# EAGLE design tuya-jailbeaker (EAGLE 9.6.2)
CNAME: None; CREVISION: 1; DESIGNER: Joao Silva
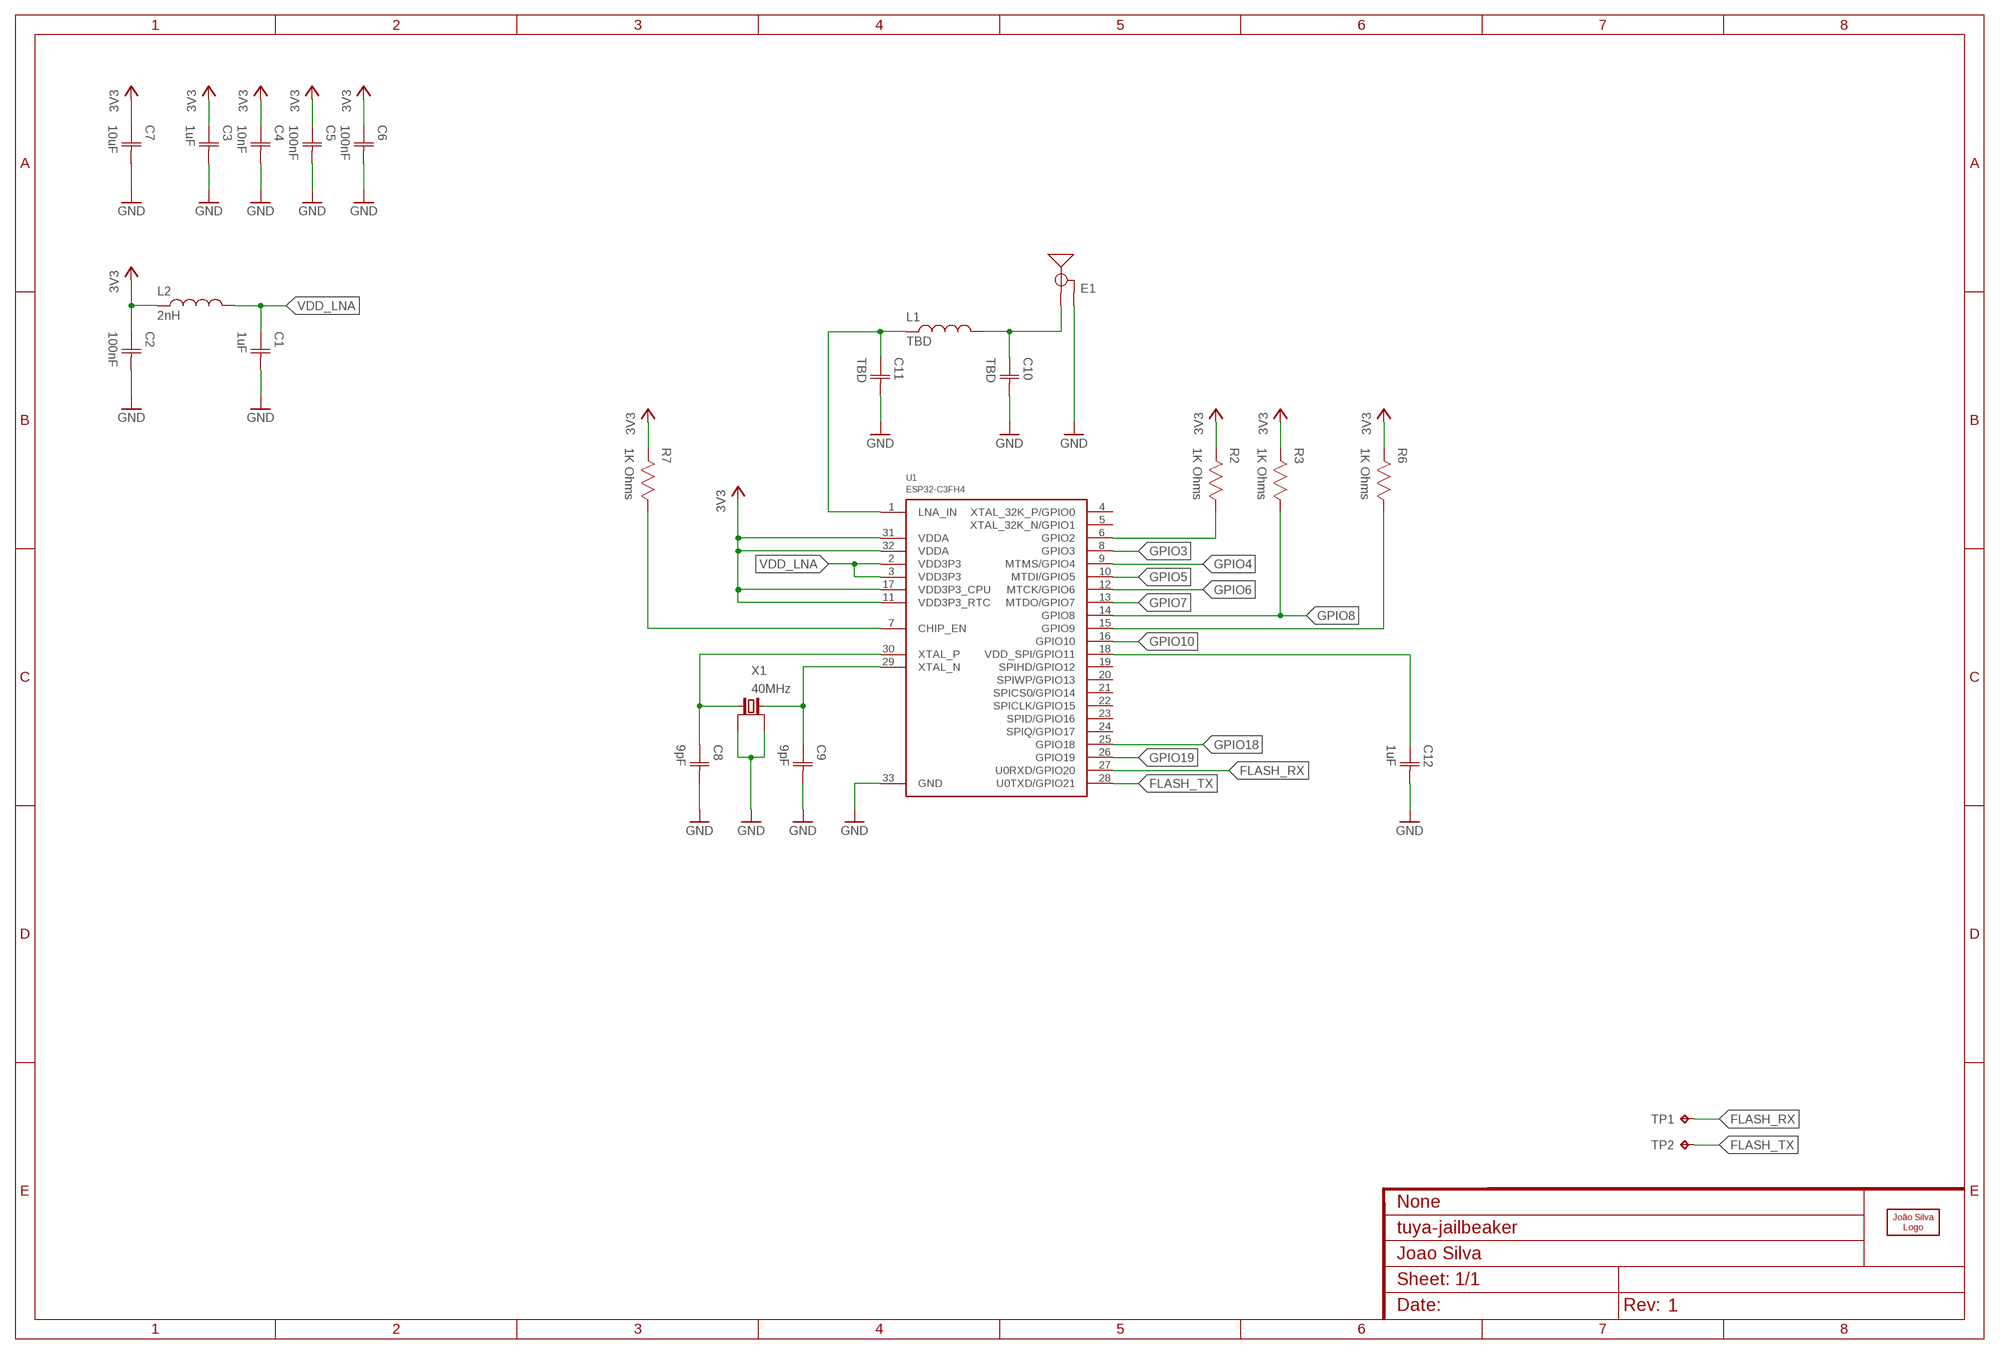
[diagram p0: schematic, sheet 1]

## Parts
C1  1uF  CAPACITOR-0402  [CAP0402]
C2  100nF  CAPACITOR-0402  [CAP0402]
C3  1uF  CAPACITOR-0402  [CAP0402]
C4  10nF  CAPACITOR-0402  [CAP0402]
C5  100nF  CAPACITOR-0402  [CAP0402]
C6  100nF  CAPACITOR-0402  [CAP0402]
C7  10uF  CAPACITOR-0603  [CAP0603]
C8  9pF  CAPACITOR-0402  [CAP0402]
C9  9pF  CAPACITOR-0402  [CAP0402]
C10  TBD  CAPACITOR-0402  [CAP0402]
C11  TBD  CAPACITOR-0402  [CAP0402]
C12  1uF  CAPACITOR-0402  [CAP0402]
E1  2.4GHZ  [OLIMEX_ANT_ESP8266_ANT]
L1  TBD  INDUCTOR-0402  [IND0402]
L2  2nH  INDUCTOR-0402  [IND0402]
LOGO1  JS-5MM  [JS_5MM]
R2  1K Ohms  RESISTOR-0402  [RES0402]
R3  1K Ohms  RESISTOR-0402  [RES0402]
R6  1K Ohms  RESISTOR-0402  [RES0402]
R7  1K Ohms  RESISTOR-0402  [RES0402]
TP1  TESTPOINT-1.27MM  [PAD1.27MM]
TP2  TESTPOINT-1.27MM  [PAD1.27MM]
U1  ESP32-C3FH4  [QFN32]
X1  40MHz  CRYSTAL_4P-2520  [4-SMD-2520]

## Nets
3V3: C2.1(C1) C3.1(C1) C4.1(C1) C5.1(C1) C6.1(C1) C7.1(C1) L2.1 R2.2 R3.2 R6.2 R7.2 U1.11(VDD3P3_RTC) U1.17(VDD3P3_CPU) U1.31(VDDA) U1.32(VDDA)
ANT: C10.1(C1) E1.ANT(SIGNAL) L1.2
CEN: R7.1 U1.7(CHIP_EN)
FLASH_RX: TP1.TP U1.27(U0RXD/GPIO20)
FLASH_TX: TP2.TP U1.28(U0TXD/GPIO21)
GND: C1.2(C2) C2.2(C2) C3.2(C2) C4.2(C2) C5.2(C2) C6.2(C2) C7.2(C2) C8.2(C2) C9.2(C2) C10.2(C2) C11.2(C2) C12.2(C2) E1.GND U1.33(GND) X1.2(GND) X1.4(GND)
GPIO2: R2.1 U1.6(GPIO2)
GPIO3: U1.8(GPIO3)
GPIO4: U1.9(MTMS/GPIO4)
GPIO5: U1.10(MTDI/GPIO5)
GPIO6: U1.12(MTCK/GPIO6)
GPIO7: U1.13(MTDO/GPIO7)
GPIO8: R3.1 U1.14(GPIO8)
GPIO9: R6.1 U1.15(GPIO9)
GPIO10: U1.16(GPIO10)
GPIO18: U1.25(GPIO18)
GPIO19: U1.26(GPIO19)
LNA_IN: C11.1(C1) L1.1 U1.1(LNA_IN)
VDD_LNA: C1.1(C1) L2.2 U1.2(VDD3P3) U1.3(VDD3P3)
VDD_SPI: C12.1(C1) U1.18(VDD_SPI/GPIO11)
XTALN: C9.1(C1) U1.29(XTAL_N) X1.1
XTALP: C8.1(C1) U1.30(XTAL_P) X1.3
Unconnected: U1.4(XTAL_32K_P/GPIO0) U1.5(XTAL_32K_N/GPIO1) U1.19(SPIHD/GPIO12) U1.20(SPIWP/GPIO13) U1.21(SPICS0/GPIO14) U1.22(SPICLK/GPIO15) U1.23(SPID/GPIO16) U1.24(SPIQ/GPIO17)

## Library data of the parts
C1-C12 = Capacitor:CAPACITOR
E1 = Antenna:2.4GHZ
L1 L2 = Inductor:INDUCTOR
LOGO1 = Silkscreen:JS
R2 R3 R6 R7 = Resistor:RESISTOR
TP1 TP2 = PADs:TESTPOINT
U1 = Espressif:ESP32-C3*
X1 = Crystal:CRYSTAL_4P; OCLCSC: C709005

## Board
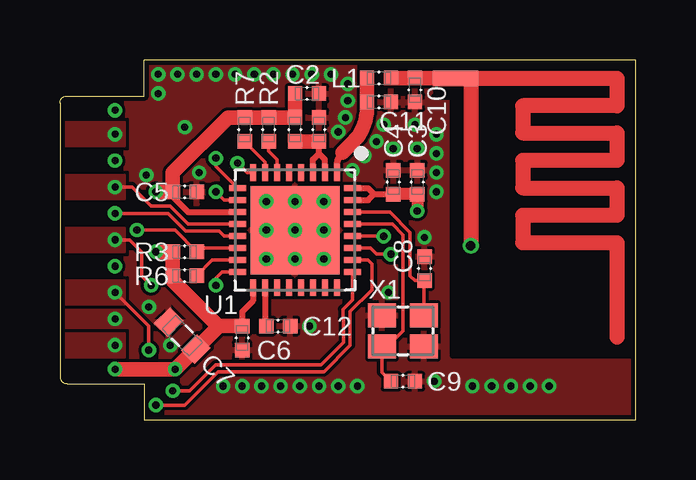
[diagram p1: board, top side]
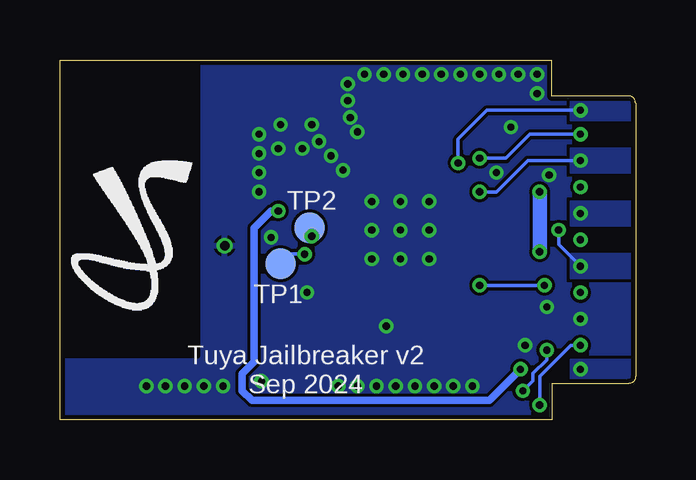
[diagram p2: board, bottom side, seen from below]

Size 24 x 15 mm. Coordinates in mm from the lower left corner, seen from the top.
Outline: 3.5,0 24,0 24,15 3.5,15 3.5,13.5 0.3,13.5 arc90 0,13.2 0,1.8 arc90 0.3,1.5 3.5,1.5 3.5,0
Copper layers (1*16): Top 0.035mm / dielectric 1.6mm / Bottom 0.035mm
Design rules "jlcpcb_2layer": minimum track width 5mil, minimum drill 0.3mm, track to track 5mil, track to pad 5mil, pad to pad 5mil, via to via 5mil, smd to smd 5mil, copper to edge 0.2mm, drill to drill 5mil, minimum pad ring 0.13mm, minimum via ring 0.1mm, stop-mask expansion 0.04mm, vias tented up to drill 10mm, thermal gap 5mil

### Footprints (pad centres in the part's own frame; a part is rotated, then mirrored left to right if it is on the bottom)
CAP0402 = smd 0.6 x 0.6: 1 -0.5,0; 2 0.5,0
CAP0603 = smd 0.8 x 0.95: 1 -0.8,0; 2 0.8,0
OLIMEX_ANT_ESP8266_ANT = smd 0.635 x 1.905: ANT -5.334,-3.302 | drill 0.4 pad 0.635: GND 1.651,-2.667
IND0402 = smd 0.6 x 0.6: 1 -0.5,0; 2 0.5,0
RES0402 = smd 0.6 x 0.6: 1 -0.5,0; 2 0.5,0
PAD1.27MM = smd 1.27 x 1.27: TP 0,0
QFN32 = smd 0.7 x 0.25: 1 -2.4,1.75; 2 -2.4,1.25; 3 -2.4,0.75; 4 -2.4,0.25; 5 -2.4,-0.25; 6 -2.4,-0.75; 7 -2.4,-1.25; 8 -2.4,-1.75; 17 2.4,-1.75; 18 2.4,-1.25; 19 2.4,-0.75; 20 2.4,-0.25; 21 2.4,0.25; 22 2.4,0.75; 23 2.4,1.25; 24 2.4,1.75 | smd 0.25 x 0.7: 9 -1.75,-2.4; 10 -1.25,-2.4; 11 -0.75,-2.4; 12 -0.25,-2.4; 13 0.25,-2.4; 14 0.75,-2.4; 15 1.25,-2.4; 16 1.75,-2.4; 25 1.75,2.4; 26 1.25,2.4; 27 0.75,2.4; 28 0.25,2.4; 29 -0.25,2.4; 30 -0.75,2.4; 31 -1.25,2.4; 32 -1.75,2.4 | smd 3.7 x 3.7: 33 0,0
4-SMD-2520 = smd 1.15 x 1: 1 -0.875,-0.65; 2 0.875,-0.65; 3 0.875,0.65; 4 -0.875,0.65

### Placement (x,y rotation side)
C1  10.8,12.1 90 top
C2  10.3,13.6 0 top
C3  14.9,9.9 90 top
C4  13.9,9.9 90 top
C5  5.2,9.5 0 top
C6  7.6,3.4 270 top
C7  5.1,3.5 135 top
C8  15.2,6.3 90 top
C9  14.3,1.6 0 top
C10  14.8,13.75 270 top
C11  13.3,13.25 0 top
C12  9.1,3.9 0 top
E1  19.8,8.9 270 top
L1  13.3,14.25 0 top
L2  9.8,12.1 270 top
LOGO1  18.3,11 0 bottom
R2  8.7,12.1 90 top
R3  5.2,7 180 top
R6  5.2,6 180 top
R7  7.7,12.1 90 top
TP1  14.8,6.5 0 bottom
TP2  13.6,8 0 bottom
U1  9.8,7.9 270 top
X1  14.3,3.7 0 top

### Tracks (layer width: path | path; a pad name or v marks a point on that pad's centre or on a via)
3V3  (via drill 0.3)
  Top 0.254: C5.1 4.7,9.3 5.35,8.65 U1.11 | U1.17 8.05,4.95 7.6,4.5 C6.1 | U1.32 12.85,9.65 13.1,9.4 | 13.1,9.4 12.85,9.15 U1.31 | 13.1,9.4 C4.1
  Top 0.508: C4.1 C3.1 v14.9,8.7
  Top 0.61: C2.1 L2.1 R2.2 R7.2 7,12.6 4.7,10.3 C5.1 v4,9.5 | 6.6,3.9 4.7,5.8 R6.2 R3.2 v4,7 | C6.1 6.6,3.9 | v2.3,2.1 v4.8,2.1 5.63,2.93 C7.1 6.6,3.87 6.6,3.9
  Bottom 0.305: v14.9,8.7 15.2,8.7 15.9,8 15.9,2.4 16.4,1.9 16.4,1.2 16,0.8 6.1,0.8 v4.8,2.1
  Bottom 0.61: v4,9.5 v4,7
  pour Bottom: 0,1.5 0,2.5 2.7,2.5 2.7,1.5
ANT
  Top 0.61: L1.2 C10.1 16.48,14.25 E1.ANT
CEN
  Top 0.152: U1.7 8.55,10.75 R7.1
FLASH_RX  (via drill 0.3)
  Top 0.152: U1.27 12.95,7.15 13.2,6.9 v13.8,6.9
  Bottom 0.152: v13.8,6.9 14.4,6.9 TP1.TP
FLASH_TX  (via drill 0.3)
  Top 0.152: U1.28 v13.5,7.65
  Bottom 0.152: TP2.TP 13.6,7.75 v13.5,7.65
GND  (via drill 0.3)
  other vias: 15.6,1.6 11,6.7 11,7.9 11,9.1 9.8,9.1 8.6,9.1 8.6,7.9 8.6,6.7 9.8,6.7 4.1,14.4 4.9,14.4 5.7,14.4 4.1,13.6 8.9,14.4 9.7,14.4 6.5,14.4 7.3,14.4 8.1,14.4 20.4,1.4 17.2,1.4 18,1.4 18.8,1.4 19.6,1.4 10.8,1.4 6.8,1.4 7.6,1.4 8.4,1.4 9.2,1.4 10,1.4 13.7,5.3 9.8,7.9 13.5,12.3 12.4,1.4 11.6,1.4 15.2,7.6 15.7,10.3 15.7,11.1 15.7,11.9 11.6,12 13.2,11.6 14.8,12.3 15.7,9.5 11.9,12.6 12,13.3 11.3,14.4 10.5,14.4 5.8,10.3 14.9,11.3 13.9,11.3 10.4,3.9 2.3,4.2 3.6,10.2 3.7,4.7 4.6,3.1 5.2,12.2 12,14 12.2,10.4 12.7,11
  pour Bottom: 0,3.7 0,4.7 2.7,4.7 2.7,3.7
  pour Top (rank 6): -1,-1 25.5,-1 25.5,16 -1,16
  pour Bottom (rank 6): -2,-2 26.5,-2 26.5,17 -2,17
GPIO2
  Top 0.152: U1.6 9.05,10.85 8.7,11.2 R2.1
GPIO3  (via drill 0.3)
  Top 0.152: U1.8 7.8,10.3 v7.4,10.7
  Bottom 0.152: v7.4,10.7 7.4,11.19 7.4,11.7 6.2,12.9 v2.3,12.9
  pour Bottom: 0,12.5 0,13.5 2.7,13.5 2.7,12.5
GPIO4  (via drill 0.3)
  Top 0.152: U1.9 6.5,10.55 v6.5,10.9
  Bottom 0.152: v6.5,10.9 5.4,10.9 4.4,11.9 v2.3,11.9
  pour Top: 0,11.4 0,12.4 2.7,12.4 2.7,11.4
GPIO5  (via drill 0.3)
  Top 0.152: U1.10 6.85,9.15 v6.5,9.5
  Bottom 0.152: v6.5,9.5 5.8,9.5 4.5,10.8 v2.3,10.8
  pour Bottom: 0,10.3 0,11.3 2.7,11.3 2.7,10.3
GPIO6  (via drill 0.3)
  Top 0.152: v2.3,9.7 3,9.7 3.8,8.9 4.6,8.9 5.35,8.15 U1.12
  pour Top: 0,9.2 0,10.2 2.7,10.2 2.7,9.2
GPIO7  (via drill 0.3)
  Top 0.152: U1.13 6.85,7.65 6.63,7.87 5.23,7.87 4.5,8.6 v2.3,8.6
  pour Bottom: 0,8.1 0,9.1 2.7,9.1 2.7,8.1
GPIO8  (via drill 0.3)
  Top 0.152: U1.14 5.85,7.15 R3.1 4.79,7.91 v3.21,7.91
  Bottom 0.152: v3.21,7.91 3.21,7.31 v2.3,6.4
  pour Bottom: 0,5.9 0,6.9 2.7,6.9 2.7,5.9
GPIO9
  Top 0.152: U1.15 6.35,6.65 R6.1
GPIO10  (via drill 0.3)
  Top 0.152: U1.16 6.75,6.15 6.5,5.9 v6.5,5.6 | v2.3,7.5 2.9,7.5 3.4,7 3.4,6 v3.8,5.6
  Bottom 0.152: v6.5,5.6 v3.8,5.6
  pour Top: 0,7 0,8 2.7,8 2.7,7
GPIO18  (via drill 0.3)
  Top 0.152: U1.25 12.2,5 11.8,4.6 11.8,4.2 11.82,4.18 11.82,3.22 10.88,2.28 6.48,2.28 5.41,1.2 v4.7,1.2 | v3.7,2.9 3.7,3.9 v2.3,5.3
  Bottom 0.152: v4.7,1.2 4.28,1.62 4.28,1.92 3.7,2.5 v3.7,2.9
  pour Top: 0,4.8 0,5.8 2.7,5.8 2.7,4.8
GPIO19  (via drill 0.3)
  Top 0.152: U1.26 12.85,6.65 13,6.5 13,5.41 12.1,4.5 12.1,3.1 11,2 6.6,2 5.2,0.6 v4,0.6
  Bottom 0.152: v4,0.6 4,1.8 2.7,3.1 v2.3,3.1
  pour Top: 0,2.6 0,3.6 2.7,3.6 2.7,2.6
LNA_IN
  Top 0.254: 11.78,11.13 arc45 11.55,10.57 U1.1
  Top 0.61: 11.78,11.13 12.21,11.56 arc45 12.8,12.98 C11.1 L1.1
VDD_LNA
  Top 0.254: U1.2 11.05,10.85 10.8,11.1 | 10.8,11.1 C1.1 | U1.3 10.55,10.85 10.8,11.1
  Top 0.61: L2.2 C1.1
VDD_SPI
  Top 0.254: C12.1 8.55,3.9 U1.18
XTALN
  Top 0.152: U1.29 13.86,8.15 14.3,7.71 14.3,3.7 13.65,3.05 X1.1 13.43,1.98 C9.1
XTALP
  Top 0.152: U1.30 13.75,8.65 14.6,7.8 14.6,6 14.8,5.8 C8.1 15.18,5.78 X1.3

### Text on the board
bPlace: Tuya Jailbreaker v2 / Sep 2024